# Altium schematic sheet Power.SchDoc
size 420 x 297 mm; SheetNumber: 3; SheetTotal: 4
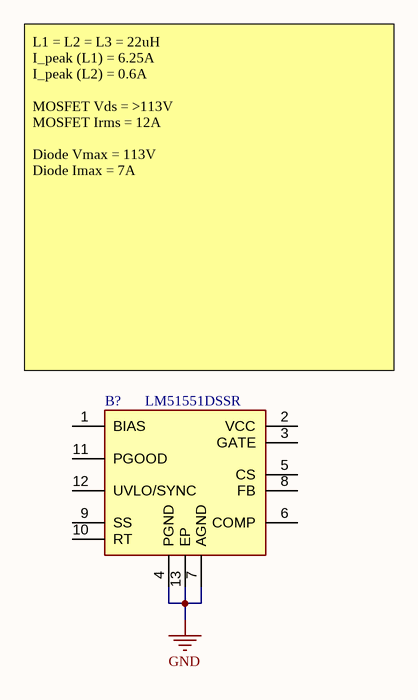
[diagram p0: Power.SchDoc]

## Parts
B?  LM51551DSSR  [SON50P200X300X80-13N-D]

## Nets
GND: B?.4(PGND) B?.7(AGND) B?.13(EP)

Not connected (* = marked no-connect by the designer): B? 1(BIAS) 2(VCC) 3(GATE) 5(CS) 6(COMP) 8(FB) 9(SS) 10(RT) 11(PGOOD) 12(UVLO/SYNC)

## Notes on the sheet
- (near B?) L1 = L2 = L3 = 22uH
  I_peak (L1) = 6.25A
  I_peak (L2) = 0.6A
  MOSFET Vds = >113V
  MOSFET Irms = 12A
  Diode Vmax = 113V
  Diode Imax = 7A
- THIS DOCUMENT AND THE DATA DISCLOSED HEREIN OR
- HEREWITH IS THE PROPERTY OF ALTIUM LIMITED AND MAY
- DWG NO:
- REVISION
- REV:
- DESCRIPTION
- DATE
- APPROVED
- BE FREELY DISTRIBUTED IN WHOLE. NO RIGHTS ARE
- RESERVED OR EXPRESS OR IMPLIED WARANTEE GIVEN.
- ENG:
- APPROVALS
- PROJECT
- DSN:
- CHK:
- REFERENCE DOCUMENTS
- PROJECT REVISION:
- TITLE
- DOCUMENT REVISION:
- DESIGN ITEM:
- BOM:
- FAB DWG:
- PCB DWG:
- ASSY DWG:
- SCALE:
- A3
- SIZE
- CAGE CODE
- FILE NAME
- DWG NO.
- SHEET
- OF
- REV

## Library data of the parts
B? = LM51551DSSR: 2.2MHz wide VIN non-synchronous boost controller; Manufacturer_Name: Texas Instruments; Geometry.Height: 0.8mm; Manufacturer_Part_Number: LM51551DSSR; Mouser Part Number: 595-LM51551DSSR; Mouser Price/Stock: https://www.mouser.co.uk/ProductDetail/Texas-Instruments/LM51551DSSR?qs=gZXFycFWdAOR5cfaNPDCBw%3D%3D; Arrow Part Number: LM51551DSSR; Arrow Price/Stock: https://www.arrow.com/en/products/lm51551dssr/texas-instruments?utm_currency=USD&region=nac; Datasheet Link: http://www.ti.com/lit/gpn/LM5155